# Altium schematic sheet Thermistor.SchDoc
size 209 x 297 mm; Address1: Address1; Address2: Address2; Address3: Address3; Address4: Address4; DocumentNumber: *Э3; SheetNumber: 3; SheetTotal: 11; DocumentType: Схема электрическая *
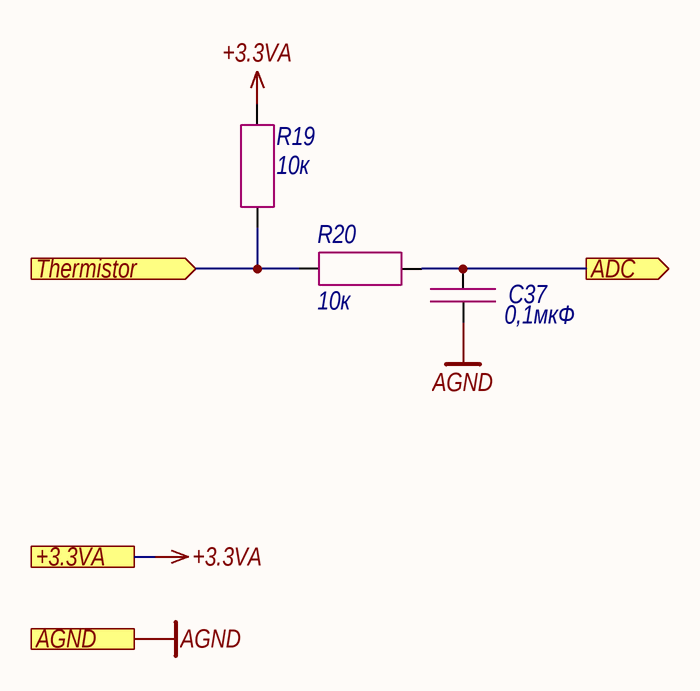
[diagram p0: Thermistor.SchDoc]

## Parts
C37  0,1мкФ  [CAP_0603]
R19  10к  [RES_0603]
R20  10к  [RES_0603]

## Ports
+3.3VA (see Main[1B], Photodiode[1C]), ADC (out, see Main[2B]), AGND (see Main[1B], Hardwiring[4D], LD_driver[1D], Photodiode[1D]), Thermistor (in, see Main[1B])

## Nets
+3.3VA: R19.1 ; port +3.3VA
AGND: C37.2 ; port AGND
ADC: C37.1 R20.2 ; port ADC
Thermistor: R19.2 R20.1 ; port Thermistor

## Notes on the sheet
- Подп. и дата
- Инв. № дубл.
- Взам. инв. №
- Инв. № подл.
- Изм.
- Лист
- № докум.
- Подп.
- Дата
- Копировал
- Формат А4

## Library data of the parts
C37 = Capacitor: Manufacturer: Murata; Model: GRM188R71H104KA93D; Value: 0,1мкФ; Document: *
R19 R20 = Resistor: Manufacturer: Yageo; Model: RC0603FR-0710KL; Value: 10к; Document: *